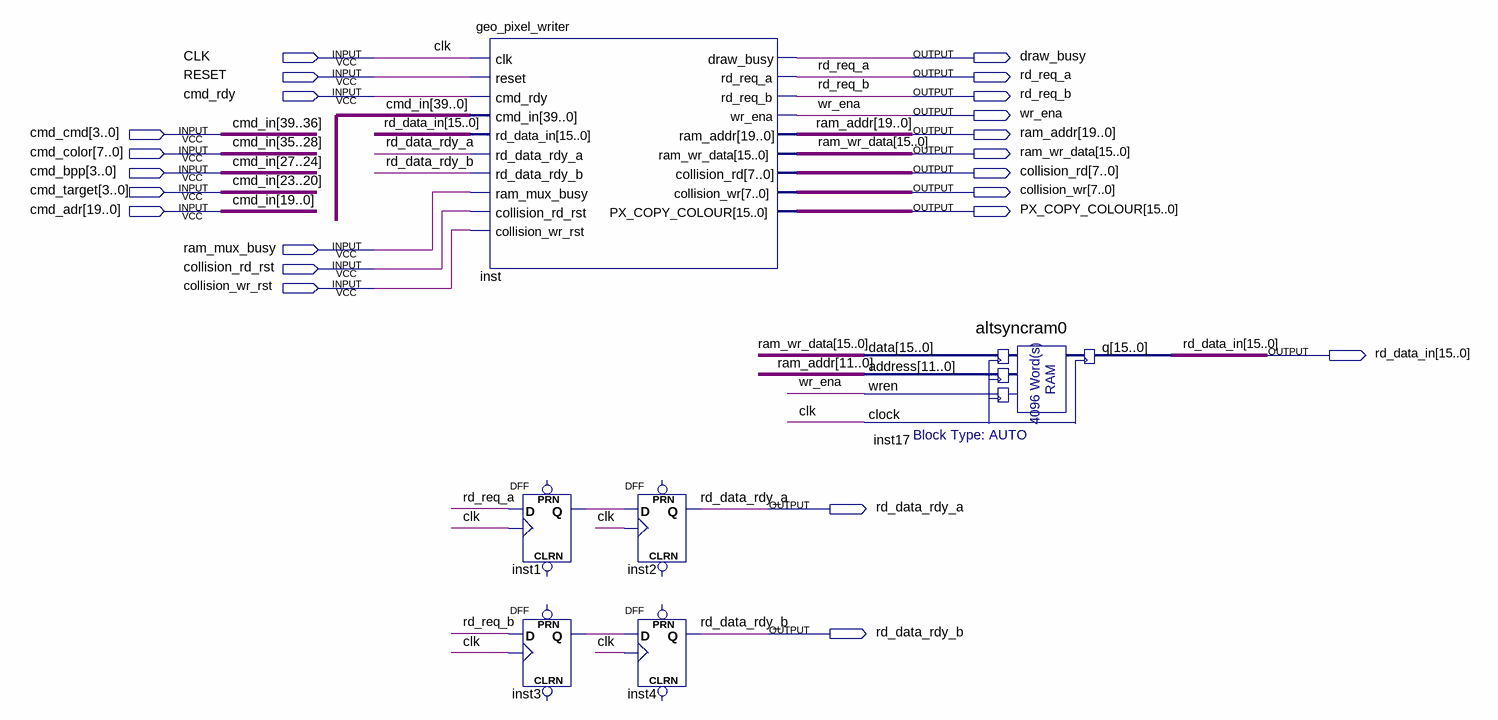
[diagram p0: schematic sheet]
// Quartus schematic pixel_writer.bdf as structural Verilog: 6 symbols, 23 pins
module pixel_writer (
  input  CLK,
  input  RESET,
  input  cmd_rdy,
  input  [3:0] cmd_cmd,
  input  [7:0] cmd_color,
  input  [3:0] cmd_bpp,
  input  [3:0] cmd_target,
  input  [19:0] cmd_adr,
  input  ram_mux_busy,
  input  collision_rd_rst,
  input  collision_wr_rst,
  output draw_busy,
  output rd_req_a,
  output rd_req_b,
  output wr_ena,
  output [19:0] ram_addr,
  output [15:0] ram_wr_data,
  output [7:0] collision_rd,
  output [7:0] collision_wr,
  output [15:0] PX_COPY_COLOUR,
  output [15:0] rd_data_in,
  output rd_data_rdy_a,
  output rd_data_rdy_b
);

  wire inst1_q, inst3_q;

  geo_pixel_writer inst (
    .clk(CLK), .reset(RESET), .cmd_rdy(cmd_rdy), .cmd_in({cmd_cmd, cmd_color, cmd_bpp, cmd_target, cmd_adr}),
    .rd_data_in(rd_data_in), .rd_data_rdy_a(rd_data_rdy_a), .rd_data_rdy_b(rd_data_rdy_b),
    .ram_mux_busy(ram_mux_busy), .collision_rd_rst(collision_rd_rst), .collision_wr_rst(collision_wr_rst),
    .draw_busy(draw_busy), .rd_req_a(rd_req_a), .rd_req_b(rd_req_b), .wr_ena(wr_ena), .ram_addr(ram_addr),
    .ram_wr_data(ram_wr_data), .collision_rd(collision_rd), .collision_wr(collision_wr),
    .PX_COPY_COLOUR(PX_COPY_COLOUR));
  DFF inst1 (.CLK(CLK), .D(rd_req_a), .Q(inst1_q));  // open: CLRN, PRN
  DFF inst3 (.CLK(CLK), .D(rd_req_b), .Q(inst3_q));  // open: CLRN, PRN
  DFF inst2 (.CLK(CLK), .D(inst1_q), .Q(rd_data_rdy_a));  // open: CLRN, PRN
  DFF inst4 (.CLK(CLK), .D(inst3_q), .Q(rd_data_rdy_b));  // open: CLRN, PRN
  altsyncram0 inst17 (.data(ram_wr_data), .address(ram_addr[11:0]), .wren(wr_ena), .clock(CLK), .q(rd_data_in));

  // Other names for the same wires on the sheet: cmd_in[39:0] = {cmd_cmd, cmd_color, cmd_bpp, cmd_target, cmd_adr}
endmodule
